# Altium schematic sheet MIC_AND_SPEAKER.SchDoc
size Letter
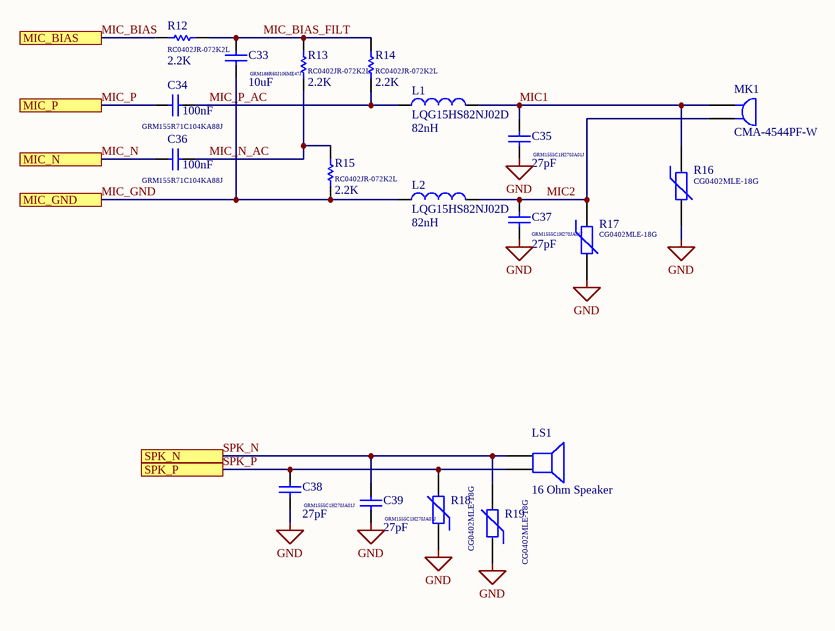
[diagram p0: MIC_AND_SPEAKER.SchDoc]

## Parts
C33  GRM188R60J106ME47J  value 10uF  [0402]
C34  GRM155R71C104KA88J  value 100nF  [0402]
C35  GRM1555C1H270JA01J  value 27pF  [0402]
C36  GRM155R71C104KA88J  value 100nF  [0402]
C37  GRM1555C1H270JA01J  value 27pF  [0402]
C38  GRM1555C1H270JA01J  value 27pF  [0402]
C39  GRM1555C1H270JA01J  value 27pF  [0402]
L1  LQG15HS82NJ02D  value 82nH  [0402-A]
L2  LQG15HS82NJ02D  value 82nH  [0402-A]
LS1  16 Ohm Speaker  [PIN2]
MK1  CMA-4544PF-W  [PIN2]
R12  RC0402JR-072K2L  value 2.2K  [0402]
R13  RC0402JR-072K2L  value 2.2K  [0402]
R14  RC0402JR-072K2L  value 2.2K  [0402]
R15  RC0402JR-072K2L  value 2.2K  [0402]
R16  CG0402MLE-18G  [6-0805_N]
R17  CG0402MLE-18G  [0402]
R18  CG0402MLE-18G  [0402]
R19  CG0402MLE-18G  [0402]

## Ports
MIC_BIAS, MIC_GND, MIC_N, MIC_P, SPK_N, SPK_P

## Nets
GND: C35.1 C37.1 C38.1 C39.1 R16.2 R17.2 R18.1 R19.1
MIC1: C35.2 L1.2 MK1.1 R16.1
MIC2: C37.2 L2.2 MK1.2 R17.1
MIC_BIAS: R12.2 ; port MIC_BIAS
MIC_BIAS_FILT: C33.2 R12.1 R13.2 R14.2
MIC_GND: C33.1 L2.1 R15.1 ; port MIC_GND
MIC_N: C36.2 ; port MIC_N
MIC_N_AC: C36.1 R13.1 R15.2
MIC_P: C34.2 ; port MIC_P
MIC_P_AC: C34.1 L1.1 R14.1
SPK_N: C39.2 LS1.1 R19.2 ; port SPK_N
SPK_P: C38.2 LS1.2 R18.2 ; port SPK_P

## Notes on the sheet
- Title
- Size:
- Date:
- Letter
- Number:
- Time:
- Revision:
- Sheet
- of
- Rocket Propulsion Laboratory
- UC San Diego
- Avionics Team
- Author :
- File:

## Library data of the parts
C33-C39 = Cap: Capacitor; Published: 8-Jun-2000; LatestRevisionDate: 17-Jul-2002; LatestRevisionNote: Re-released for DXP Platform.; PackageReference: RAD-0.3; Publisher: Altium Limited; PackageDescription: Radial Cap, Thru-Hole; 2 Leads; 0.3 in Pin Spacing
L1 L2 = Inductor: Code_IEC: 1005; Published: 8-Jun-2000; LatestRevisionDate: 29-May-2009; LatestRevisionNote: IPC-7351 Footprint Added.; PackageReference: 0402-A; Publisher: Altium Limited; PackageDescription: Chip Inductor; Code_JEITA: 0402
LS1 = Speaker: Loudspeaker; Published: 24-Mar-1999; LatestRevisionDate: 17-Jul-2002; LatestRevisionNote: Re-released for DXP Platform.; PackageReference: PIN2; Publisher: Altium Limited
MK1 = Mic1: Microphone; Published: 24-Mar-1999; LatestRevisionDate: 17-Jul-2002; LatestRevisionNote: Re-released for DXP Platform.; PackageReference: PIN2; Publisher: Altium Limited
R12-R15 = Res1: Resistor; Published: 8-Jun-2000; LatestRevisionDate: 17-Jul-2002; LatestRevisionNote: Re-released for DXP Platform.; PackageReference: AXIAL-0.3; Publisher: Altium Limited; PackageDescription: Axial Device, Thru-Hole; 2 Leads; 0.3 in Pin Spacing
R16-R19 = Res Varistor: Varistor (Voltage-Sensitive Resistor); Published: 24-Mar-1999; LatestRevisionDate: 29-May-2009; LatestRevisionNote: IPC-7351 Footprint Added.; PackageVersion: Mar-2003; PackageReference: 6-0805; Publisher: Altium Limited; PackageDescription: Chip Resistor 0805 Case Size; Code_IPC: RESC2012